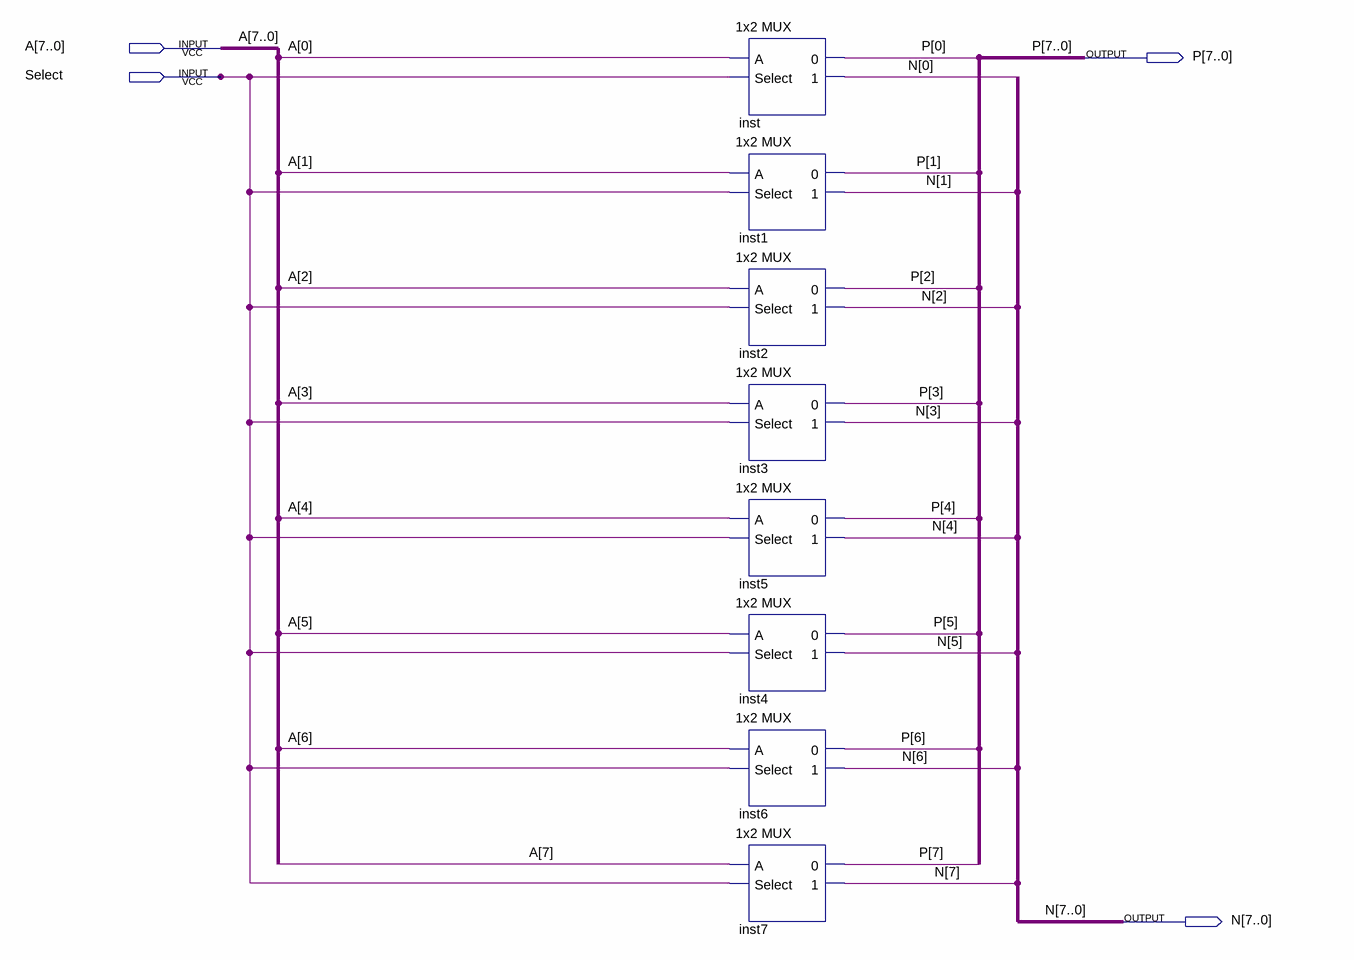
[diagram p0: schematic sheet]
// Quartus schematic 8X2 MUX.bdf as structural Verilog: 8 symbols, 4 pins
module \8X2_MUX  (
  input  [7:0] A,
  input  Select,
  output [7:0] P,
  output [7:0] N
);

  \1x2_MUX  inst (.A(A[0]), .Select(Select), .\0 (P[0]), .\1 (N[0]));
  \1x2_MUX  inst1 (.A(A[1]), .Select(Select), .\0 (P[1]), .\1 (N[1]));
  \1x2_MUX  inst2 (.A(A[2]), .Select(Select), .\0 (P[2]), .\1 (N[2]));
  \1x2_MUX  inst3 (.A(A[3]), .Select(Select), .\0 (P[3]), .\1 (N[3]));
  \1x2_MUX  inst5 (.A(A[4]), .Select(Select), .\0 (P[4]), .\1 (N[4]));
  \1x2_MUX  inst4 (.A(A[5]), .Select(Select), .\0 (P[5]), .\1 (N[5]));
  \1x2_MUX  inst6 (.A(A[6]), .Select(Select), .\0 (P[6]), .\1 (N[6]));
  \1x2_MUX  inst7 (.A(A[7]), .Select(Select), .\0 (P[7]), .\1 (N[7]));
endmodule
